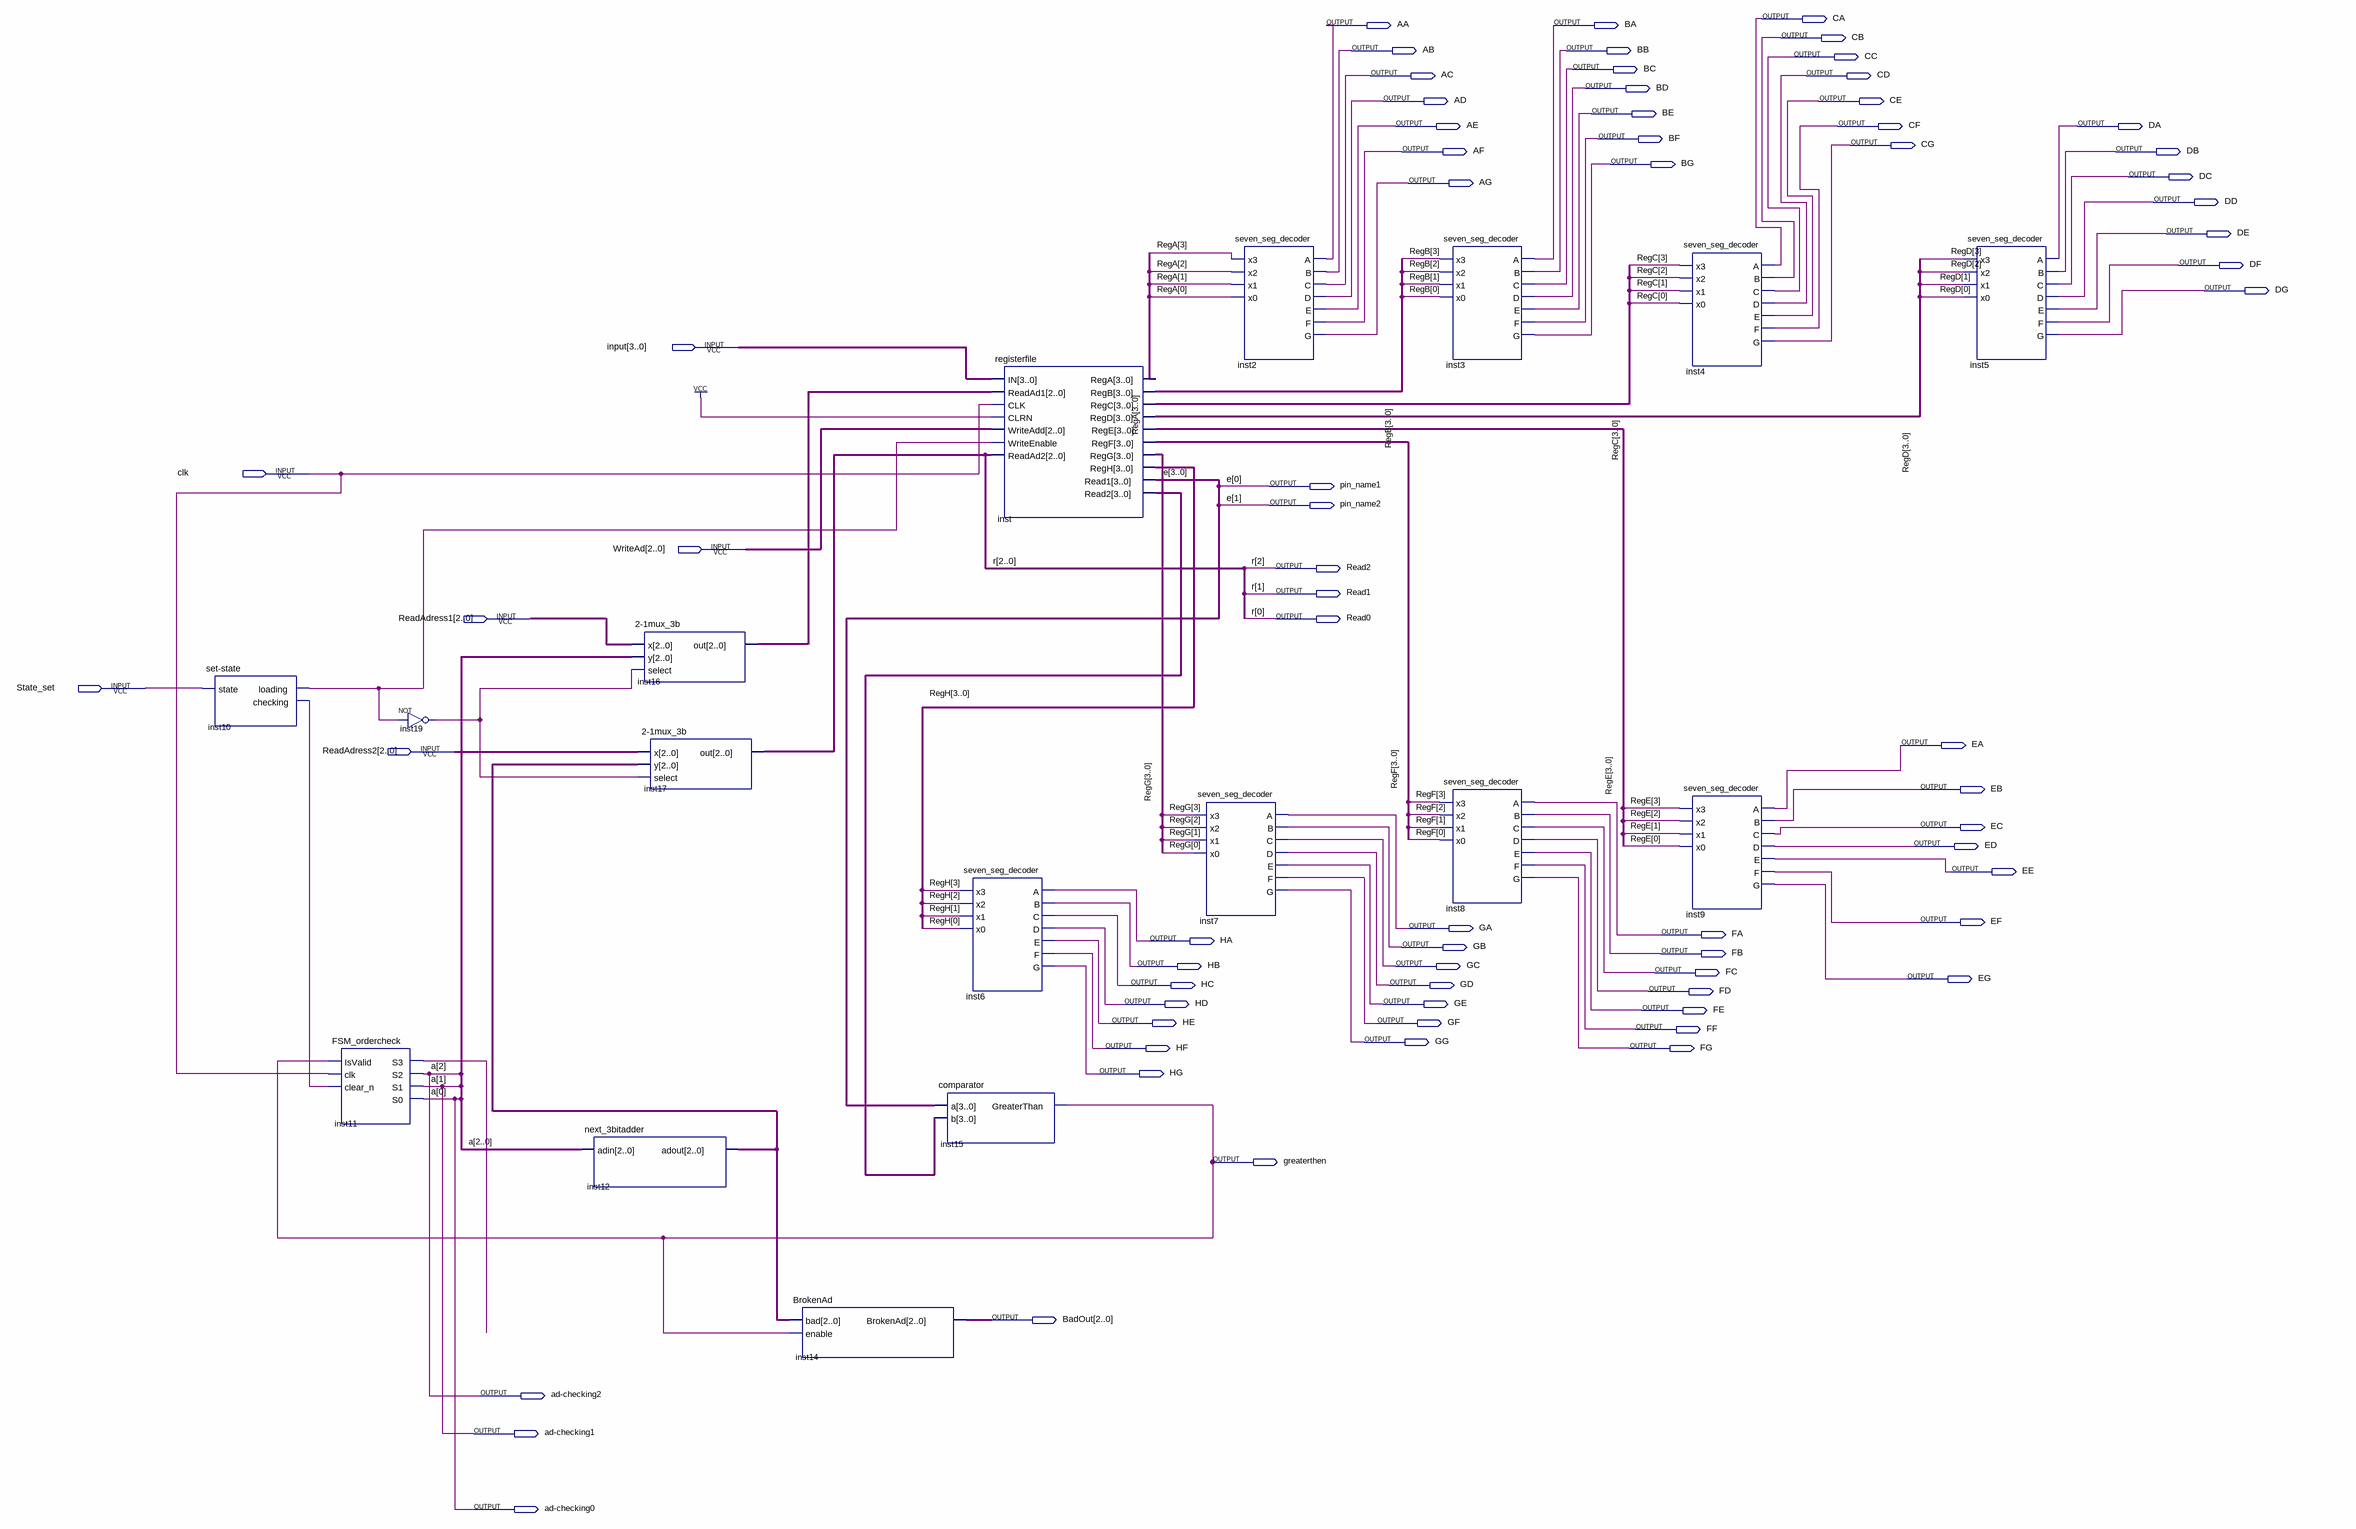
[diagram p0: schematic sheet]
// Quartus schematic final-demo.bdf as structural Verilog: 17 symbols, 72 pins
module \final-demo  (
  input  [3:0] \input ,
  input  clk,
  input  [2:0] WriteAd,
  input  [2:0] ReadAdress1,
  input  State_set,
  input  [2:0] ReadAdress2,
  output CA,
  output AA,
  output BA,
  output CB,
  output AB,
  output BB,
  output CC,
  output BC,
  output AC,
  output CD,
  output BD,
  output AD,
  output CE,
  output BE,
  output AE,
  output CF,
  output DA,
  output BF,
  output CG,
  output AF,
  output DB,
  output BG,
  output DC,
  output AG,
  output DD,
  output DE,
  output DF,
  output DG,
  output pin_name1,
  output pin_name2,
  output Read2,
  output Read1,
  output Read0,
  output EA,
  output EB,
  output EC,
  output ED,
  output EE,
  output EF,
  output GA,
  output FA,
  output HA,
  output GB,
  output FB,
  output HB,
  output GC,
  output FC,
  output EG,
  output HC,
  output GD,
  output FD,
  output HD,
  output GE,
  output FE,
  output HE,
  output GF,
  output FF,
  output GG,
  output HF,
  output FG,
  output HG,
  output greaterthen,
  output [2:0] BadOut,
  output \ad-checking2 ,
  output \ad-checking1 ,
  output \ad-checking0 
);

  wire inst10_checking, inst10_loading, inst11_s3, inst19_out;
  wire [2:0] inst12_adout, inst16_out;
  wire [3:0] inst_read2, RegA, RegB, RegC, RegD, RegE, RegF, RegG, RegH;
  wire [3:2] e;

  \set-state  inst10 (.state(State_set), .loading(inst10_loading), .checking(inst10_checking));
  FSM_ordercheck inst11 (
    .IsValid(greaterthen), .clk(clk), .clear_n(inst10_checking), .S3(inst11_s3), .S2(\ad-checking2 ),
    .S1(\ad-checking1 ), .S0(\ad-checking0 ));
  not inst19 (inst19_out, inst10_loading);
  next_3bitadder inst12 (.adin({\ad-checking2 , \ad-checking1 , \ad-checking0 }), .adout(inst12_adout));
  \2-1mux_3b  inst16 (
    .x(ReadAdress1), .y({\ad-checking2 , \ad-checking1 , \ad-checking0 }), .select(inst19_out),
    .out(inst16_out));
  \2-1mux_3b  inst17 (.x(ReadAdress2), .y(inst12_adout), .select(inst19_out), .out({Read2, Read1, Read0}));
  BrokenAd inst14 (.bad(inst12_adout), .enable(greaterthen), .BrokenAd(BadOut));
  seven_seg_decoder inst6 (
    .x3(RegH[3]), .x2(RegH[2]), .x1(RegH[1]), .x0(RegH[0]), .A(HA), .B(HB), .C(HC), .D(HD), .E(HE), .F(HF),
    .G(HG));
  comparator inst15 (.a({e, pin_name2, pin_name1}), .b(inst_read2), .GreaterThan(greaterthen));
  registerfile inst (
    .IN(\input ), .ReadAd1(inst16_out), .CLK(clk), .CLRN(1'b1), .WriteAdd(WriteAd),
    .WriteEnable(inst10_loading), .ReadAd2({Read2, Read1, Read0}), .RegA(RegA), .RegB(RegB), .RegC(RegC),
    .RegD(RegD), .RegE(RegE), .RegF(RegF), .RegG(RegG), .RegH(RegH), .Read1({e, pin_name2, pin_name1}),
    .Read2(inst_read2));
  seven_seg_decoder inst7 (
    .x3(RegG[3]), .x2(RegG[2]), .x1(RegG[1]), .x0(RegG[0]), .A(GA), .B(GB), .C(GC), .D(GD), .E(GE), .F(GF),
    .G(GG));
  seven_seg_decoder inst2 (
    .x3(RegA[3]), .x2(RegA[2]), .x1(RegA[1]), .x0(RegA[0]), .A(AA), .B(AB), .C(AC), .D(AD), .E(AE), .F(AF),
    .G(AG));
  seven_seg_decoder inst3 (
    .x3(RegB[3]), .x2(RegB[2]), .x1(RegB[1]), .x0(RegB[0]), .A(BA), .B(BB), .C(BC), .D(BD), .E(BE), .F(BF),
    .G(BG));
  seven_seg_decoder inst8 (
    .x3(RegF[3]), .x2(RegF[2]), .x1(RegF[1]), .x0(RegF[0]), .A(FA), .B(FB), .C(FC), .D(FD), .E(FE), .F(FF),
    .G(FG));
  seven_seg_decoder inst4 (
    .x3(RegC[3]), .x2(RegC[2]), .x1(RegC[1]), .x0(RegC[0]), .A(CA), .B(CB), .C(CC), .D(CD), .E(CE), .F(CF),
    .G(CG));
  seven_seg_decoder inst9 (
    .x3(RegE[3]), .x2(RegE[2]), .x1(RegE[1]), .x0(RegE[0]), .A(EA), .B(EB), .C(EC), .D(ED), .E(EE), .F(EF),
    .G(EG));
  seven_seg_decoder inst5 (
    .x3(RegD[3]), .x2(RegD[2]), .x1(RegD[1]), .x0(RegD[0]), .A(DA), .B(DB), .C(DC), .D(DD), .E(DE), .F(DF),
    .G(DG));

  // Other names for the same wires on the sheet: a[2:0] = {\ad-checking2 , \ad-checking1 , \ad-checking0 };
  //   e[1:0] = {pin_name2, pin_name1}; r[2:0] = {Read2, Read1, Read0}
endmodule
